# EAGLE design SensorNode_A (EAGLE 5.11)
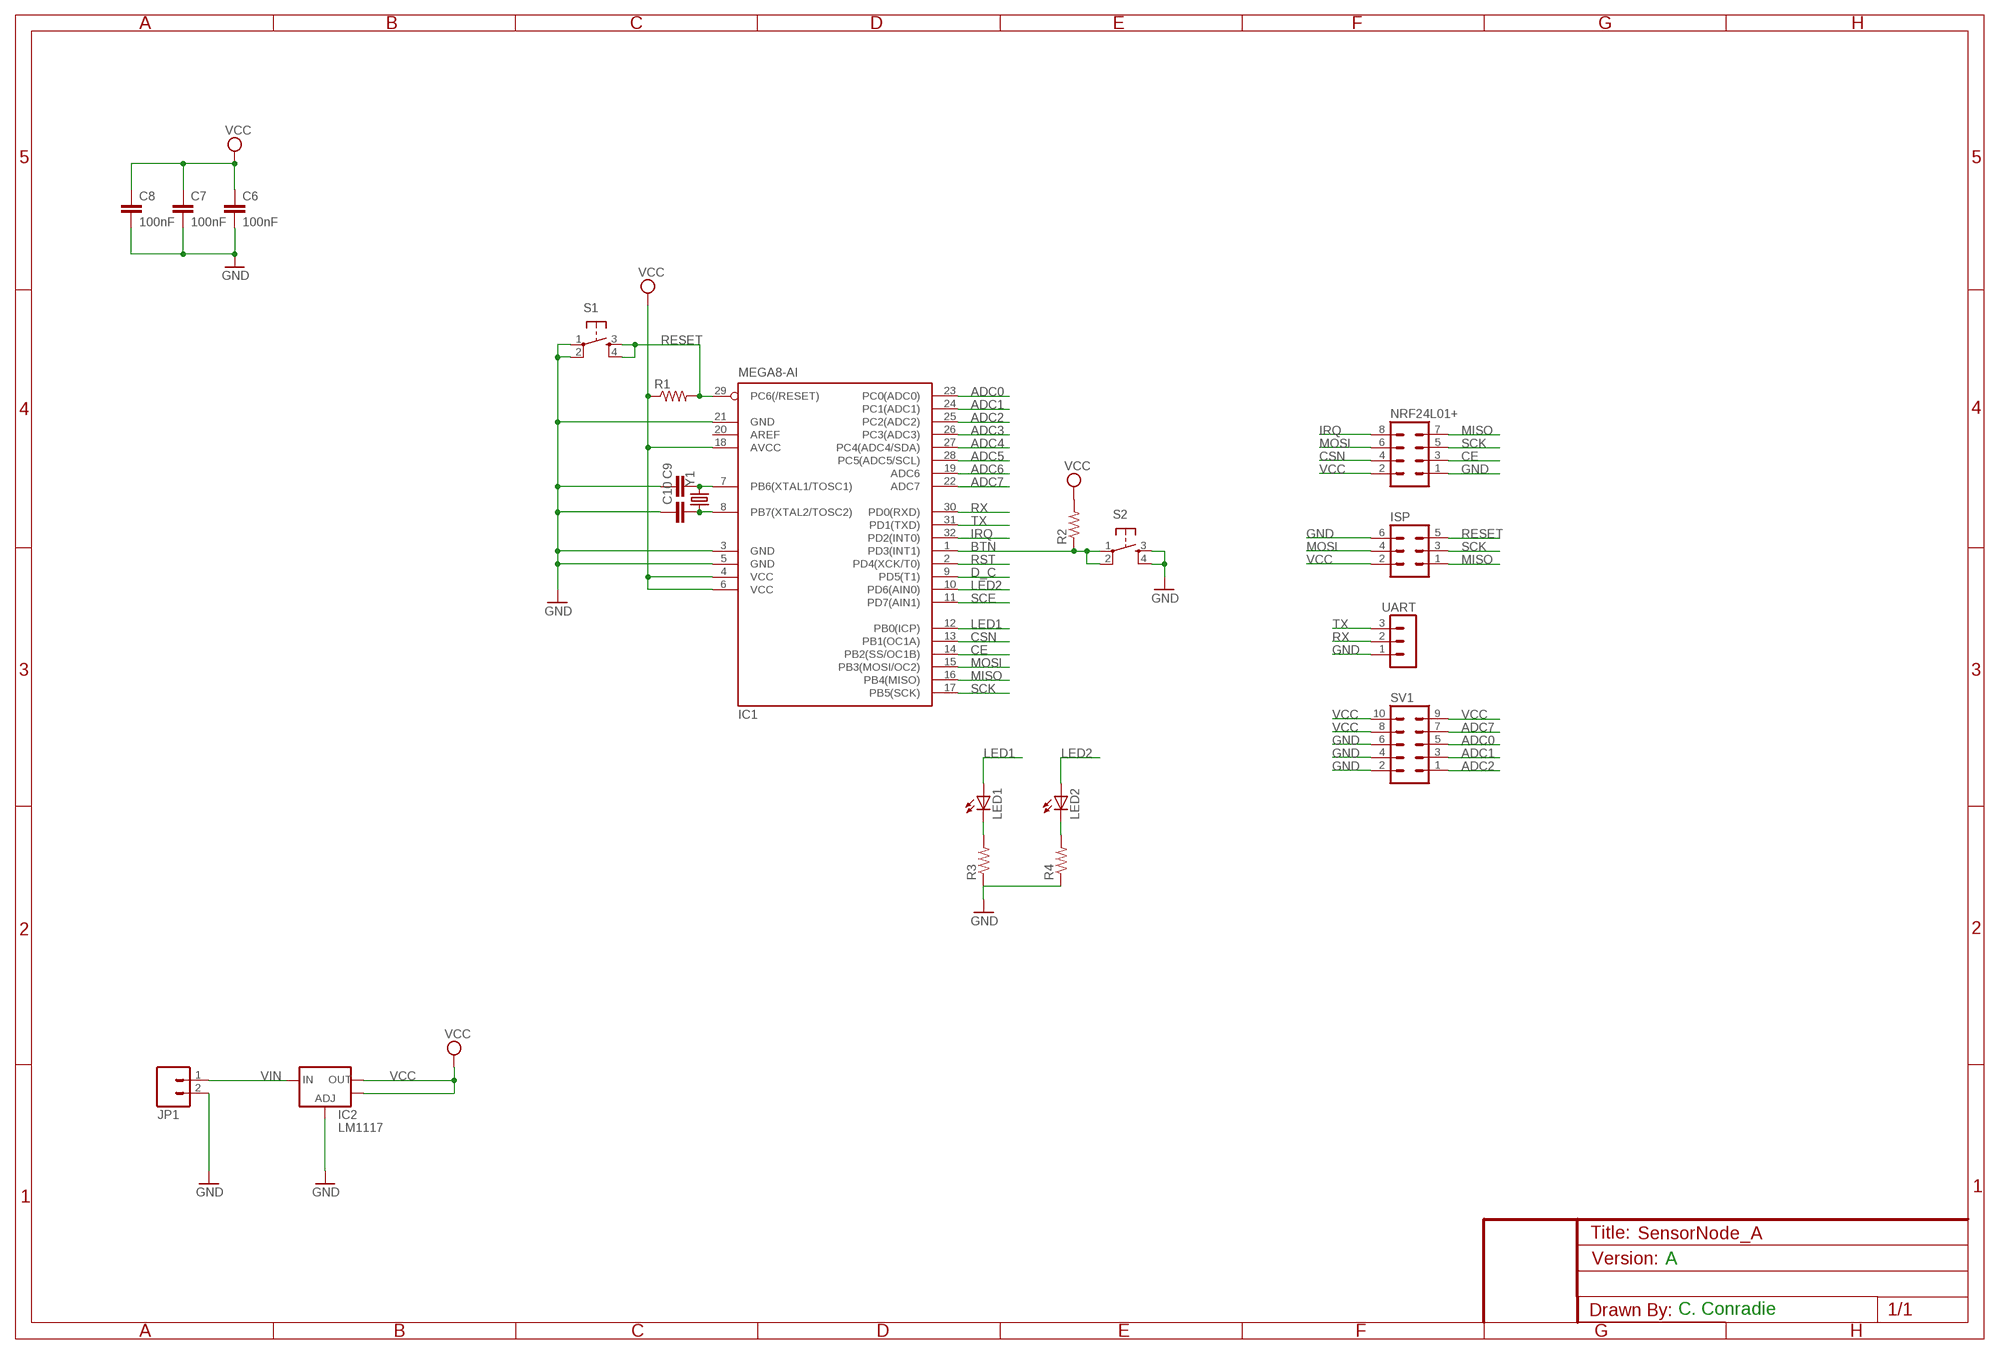
[diagram p0: schematic, sheet 1]

## Parts
C6  100nF  CAP1206  [1206]
C7  100nF  CAP1206  [1206]
C8  100nF  CAP1206  [1206]
C9  CAP0805  [0805]
C10  CAP0805  [0805]
IC1  MEGA8-AI  [TQFP32-08]
IC2  LM1117  V_REG_LM1117SOT223  [SOT223]
ISP  MA03-2  [MA03-2]
JP1  M02POLAR  [MOLEX-1X2]
LED1  LED1206  [LED-1206]
LED2  LED1206  [LED-1206]
NRF24L01+  MA04-2  [MA04-2]
R1  RESISTOR1206  [1206]
R2  RESISTOR1206  [1206]
R3  RESISTOR1206  [1206]
R4  RESISTOR1206  [1206]
S1  TAC_SWITCHSMD  [TACTILE_SWITCH_SMD]
S2  TAC_SWITCHSMD  [TACTILE_SWITCH_SMD]
SV1  MA05-2  [MA05-2]
UART  MA03-1  [MA03-1]
Y1  CRYSTALSMD  [HC49UP]

## Nets
ADC0: IC1.23(PC0(ADC0)) SV1.5
ADC1: IC1.24(PC1(ADC1)) SV1.3
ADC2: IC1.25(PC2(ADC2)) SV1.1
ADC3: IC1.26(PC3(ADC3))
ADC4: IC1.27(PC4(ADC4/SDA))
ADC5: IC1.28(PC5(ADC5/SCL))
ADC6: IC1.19(ADC6)
ADC7: IC1.22(ADC7) SV1.7
BTN: IC1.1(PD3(INT1)) R2.1 S2.1 S2.2
CE: IC1.14(PB2(SS/OC1B)) NRF24L01+.3
CSN: IC1.13(PB1(OC1A)) NRF24L01+.4
D_C: IC1.9(PD5(T1))
GND: C6.2 C7.2 C8.2 C9.1 C10.1 IC1.3(GND) IC1.5(GND) IC1.21(GND) IC2.1(ADJ) ISP.6 JP1.2 NRF24L01+.1 R3.1 R4.1 S1.1 S1.2 S2.3 S2.4 SV1.2 SV1.4 SV1.6 UART.1
IRQ: IC1.32(PD2(INT0)) NRF24L01+.8
LED1: IC1.12(PB0(ICP)) LED1.A
LED2: IC1.10(PD6(AIN0)) LED2.A
MISO: IC1.16(PB4(MISO)) ISP.1 NRF24L01+.7
MOSI: IC1.15(PB3(MOSI/OC2)) ISP.4 NRF24L01+.6
N$1: C9.2 IC1.7(PB6(XTAL1/TOSC1)) Y1.2
N$2: C10.2 IC1.8(PB7(XTAL2/TOSC2)) Y1.1
N$6: LED1.C R3.2
N$7: LED2.C R4.2
RESET: IC1.29(PC6(/RESET)) ISP.5 R1.2 S1.3 S1.4
RST: IC1.2(PD4(XCK/T0))
RX: IC1.30(PD0(RXD)) UART.2
SCE: IC1.11(PD7(AIN1))
SCK: IC1.17(PB5(SCK)) ISP.3 NRF24L01+.5
TX: IC1.31(PD1(TXD)) UART.3
VCC: C6.1 C7.1 C8.1 IC1.4(VCC) IC1.6(VCC) IC1.18(AVCC) IC2.2(OUT) IC2.4(OUT) ISP.2 NRF24L01+.2 R1.1 R2.2 SV1.8 SV1.9 SV1.10
VIN: IC2.3(IN) JP1.1
Unconnected: IC1.20(AREF)

## Notes on the sheet
- A
- C. Conradie

## Library data of the parts
C6-C10 = SparkFun:CAP: Capacitor Standard 0603 ceramic capacitor, and 0.1" leaded capacitor.
IC1 = atmel:MEGA8: MICROCONTROLLER 8 Kbytes FLASH, 1 kbytes SRAM, 512 bytes EEPROM, USART, 6-channel 10 bit ADC, 2-channel 8 bit ADC Pin compatible with Atmega48, ATMega88, ATMega168 Source: avr.lbr; MPN: ATMEGA8-16AU; OC_FARNELL: 9171371; OC_NEWARK: 73M8863
IC2 = SparkFun:V_REG_LM1117: Voltage Regulator LM1117 Standard adjustable voltage regulator but in SMD form. Spark Fun Electronics SKU : COM-00595
ISP = con-lstb:MA03-2: PIN HEADER; OC_FARNELL: unknown; OC_NEWARK: unknown
JP1 = SparkFun:M02: Header 2 Standard 2-pin 0.1" header. Use with straight break away headers (SKU : PRT-00116), right angle break away headers (PRT-00553), swiss pins (PRT-00743), machine pins (PRT-00117), and female headers (PRT-00115). Molex polarized connector foot print use with SKU : PRT-08233 with associated crimp pins and housings.
LED1 LED2 = SparkFun:LED: LEDs Standard schematic elements and footprints for 5mm, 3mm, 1206, and 0603 sized LEDs. 5mm - Spark Fun Electronics SKU : COM-00529 (and others)
NRF24L01+ = con-lstb:MA04-2: PIN HEADER; OC_FARNELL: unknown; OC_NEWARK: unknown
R1-R4 = SparkFun:RESISTOR: Resistor Basic schematic elements and footprints for 0603, 1206, and PTH resistors.
S1 S2 = SparkFun:TAC_SWITCH: Momentary Switch Button commonly used for reset or general input. Spark Fun Electronics SKU : COM-00097
SV1 = con-lstb:MA05-2: PIN HEADER; OC_FARNELL: unknown; OC_NEWARK: unknown
UART = con-lstb:MA03-1: PIN HEADER; OC_FARNELL: unknown; OC_NEWARK: unknown
Y1 = SparkFun:CRYSTAL: Crystals Various standard crystals. Proven footprints. Spark Fun Electronics SKU : COM-00534

## Board
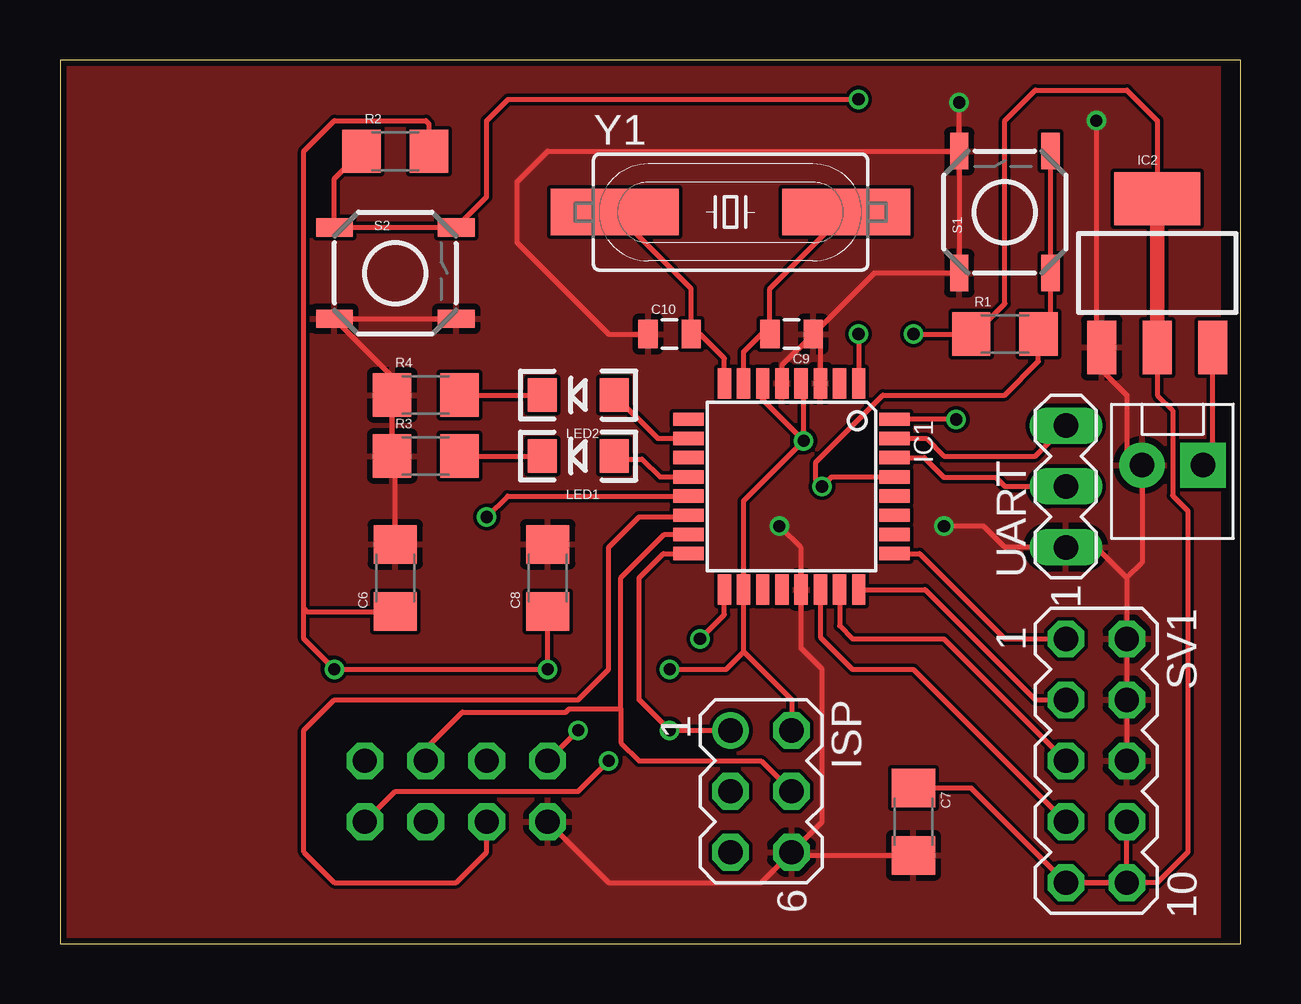
[diagram p1: board, top side]
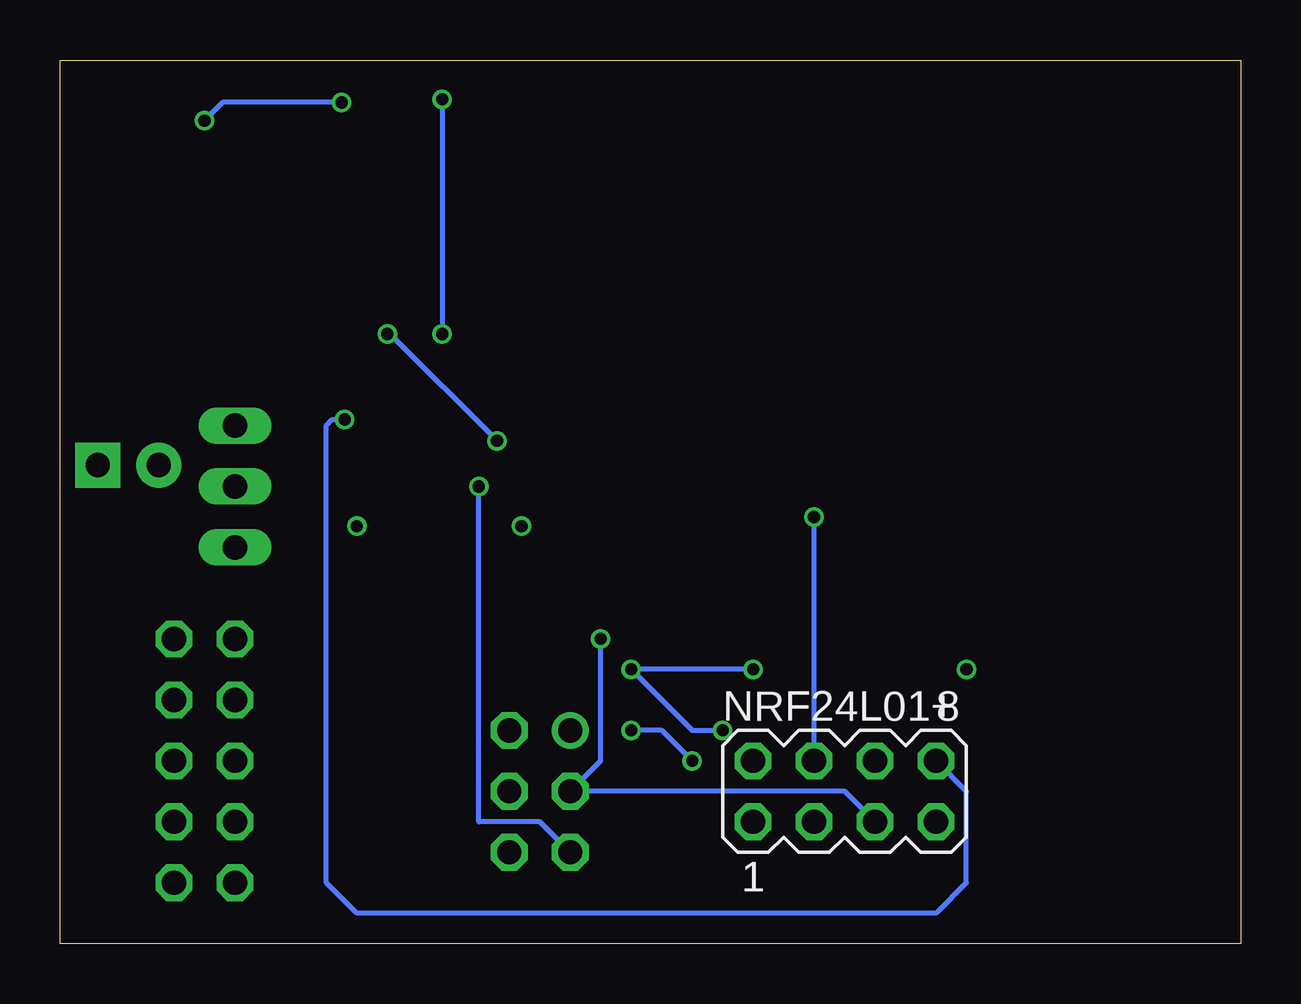
[diagram p2: board, bottom side, seen from below]

Size 49.2 x 36.82 mm. Coordinates in mm from the lower left corner, seen from the top.
Outline: 0,0 49.2,0 49.2,36.82 0,36.82 0,0
Copper layers (1*16): Top 0.035mm / dielectric 1.5mm / Bottom 0.035mm
Design rules "ITead_rule": minimum track width 6mil, minimum drill 12mil, track to track 6mil, track to pad 6mil, pad to pad 6mil, via to via 6mil, smd to smd 0mil, copper to edge 10mil, drill to drill 10mil, minimum pad ring 10mil, minimum via ring 6mil, stop-mask expansion 2mil, vias tented up to drill 100mil, thermal gap 10mil

### Footprints (pad centres in the part's own frame; a part is rotated, then mirrored left to right if it is on the bottom)
1206 = smd 1.6 x 1.8: 1 -1.4,0; 2 1.4,0
0805 = smd 0.8 x 1.2: 1 -0.9,0; 2 0.9,0
TQFP32-08 = smd 1.27 x 0.559: 1 -4.293,2.8; 2 -4.293,2; 3 -4.293,1.2; 4 -4.293,0.4; 5 -4.293,-0.4; 6 -4.293,-1.2; 7 -4.293,-2; 8 -4.293,-2.8; 17 4.293,-2.8; 18 4.293,-2; 19 4.293,-1.2; 20 4.293,-0.4; 21 4.293,0.4; 22 4.293,1.2; 23 4.293,2; 24 4.293,2.8 | smd 0.559 x 1.27: 9 -2.8,-4.293; 10 -2,-4.293; 11 -1.2,-4.293; 12 -0.4,-4.293; 13 0.4,-4.293; 14 1.2,-4.293; 15 2,-4.293; 16 2.8,-4.293; 25 2.8,4.293; 26 2,4.293; 27 1.2,4.293; 28 0.4,4.293; 29 -0.4,4.293; 30 -1.2,4.293; 31 -2,4.293; 32 -2.8,4.293
SOT223 = smd 1.219 x 2.235: 1 -2.311,-3.099; 2 0,-3.099; 3 2.311,-3.099 | smd 3.6 x 2.2: 4 0,3.099
MA03-2 = drill 1.016 round: 1 -2.54,-1.27 | drill 1.016 octagon: 2 -2.54,1.27; 3 0,-1.27; 4 0,1.27; 5 2.54,-1.27; 6 2.54,1.27
MOLEX-1X2 = drill 1.016 pad 1.88 square: 1 0,0 | drill 1.016 pad 1.88 round: 2 2.54,0
LED-1206 = smd 1.2 x 1.4: A -1.5,0; C 1.5,0
MA04-2 = drill 1.016 octagon: 1 -3.81,-1.27; 2 -3.81,1.27; 3 -1.27,-1.27; 4 -1.27,1.27; 5 1.27,-1.27; 6 1.27,1.27; 7 3.81,-1.27; 8 3.81,1.27
TACTILE_SWITCH_SMD = smd 1.524 x 0.762: 1 -2.54,1.905; 2 2.54,1.905; 3 -2.54,-1.905; 4 2.54,-1.905
MA05-2 = drill 1.016 octagon: 1 -5.08,-1.27; 2 -5.08,1.27; 3 -2.54,-1.27; 4 -2.54,1.27; 5 0,-1.27; 6 0,1.27; 7 2.54,-1.27; 8 2.54,1.27; 9 5.08,-1.27; 10 5.08,1.27
MA03-1 = drill 1.016 long: 1 -2.54,0; 2 0,0; 3 2.54,0
HC49UP = smd 5.334 x 1.93: 1 -4.826,0; 2 4.826,0

### Placement (x,y rotation side)
C6  13.97,15.24 90 top
C7  35.56,5.08 270 top
C8  20.32,15.24 90 top
C9  30.48,25.4 180 top
C10  25.4,25.4 0 top
IC1  30.48,19.05 270 top
IC2  45.72,27.94 0 top
ISP  29.21,6.35 270 top
JP1  47.62,19.94 180 top
LED1  21.59,20.32 180 top
LED2  21.59,22.86 180 top
NRF24L01+  16.51,6.35 0 bottom
R1  39.37,25.4 0 top
R2  13.97,33.02 0 top
R3  15.24,20.32 0 top
R4  15.24,22.86 0 top
S1  39.37,30.48 90 top
S2  13.97,27.94 0 top
SV1  43.18,7.62 270 top
UART  41.91,19.05 90 top
Y1  27.94,30.48 0 top

### Tracks (layer width: path | path; a pad name or v marks a point on that pad's centre or on a via)
ADC0
  Top 0.203: IC1.23 32.48,13.24 33.02,12.7 36.83,12.7 SV1.5
ADC1
  Top 0.203: IC1.24 36.04,14.76 40.64,10.16 SV1.3
ADC2
  Top 0.203: IC1.25 35.82,16.25 39.37,12.7 SV1.1
ADC7
  Top 0.203: IC1.22 31.68,12.77 33.02,11.43 35.56,11.43 SV1.7
BTN  (via drill 0.51)
  Top 0.203: IC1.1 v33.28,25.39 v33.27,25.4 | v33.27,35.18 18.67,35.18 17.78,34.29 17.78,31.11 S2.2 S2.1 11.43,31.88 R2.1
  Bottom 0.203: v33.27,35.18 v33.27,25.4
CE
  Top 0.203: NRF24L01+.3 17.78,3.81 16.51,2.54 11.43,2.54 10.16,3.81 10.16,8.89 11.43,10.16 21.59,10.16 22.86,11.43 22.86,16.51 24.13,17.78 26.12,17.78 IC1.14
CSN  (via drill 0.51)
  Top 0.203: IC1.13 18.65,18.65 v17.78,17.78
  Bottom 0.203: NRF24L01+.4 v17.78,17.78
GND  (via drill 0.51)
  Top 0.203: ISP.6 31.75,5.08 31.75,11.43 30.88,12.3 IC1.21 30.88,16.49 v29.97,17.4 | ISP.6 29.21,2.54 22.86,2.54 NRF24L01+.1 | C9.1 33.92,27.94 S1.1 S1.2 | IC1.3 31.68,25.1 C9.1 | SV1.6 SV1.4 SV1.2 44.45,15.24 | 44.45,15.24 43.18,16.51 UART.1 39.37,16.51 38.48,17.4 v36.83,17.4 | 43.41,24.13 43.41,23.9 44.45,22.86 44.45,20.57 JP1.2 45.09,15.88 44.45,15.24 | 43.41,24.13 IC2.1 | S1.2 v37.47,35.05 | v43.18,34.29 43.18,24.36 43.41,24.13 | IC1.5 30.08,24.1 C9.1 | C10.1 22.86,25.4 19.05,29.21 19.05,31.75 20.32,33.02 S1.2 | S2.4 S2.3 13.84,23.62 R4.1 R3.1 13.97,20.19 C6.2 | C7.2 30.61,3.68 ISP.6
  Bottom 0.203: v37.47,35.05 42.42,35.05 v43.18,34.29
  pour Top: 0,36.83 48.26,36.83 48.26,0 0,0
  pour Top (isolate 0.254): 0,36.83 22.86,36.83 22.86,0 0,0
IRQ  (via drill 0.51)
  Top 0.203: IC1.32 v37.33,21.85 v37.34,21.84
  Bottom 0.203: v37.34,21.84 37.85,21.84 38.1,21.59 38.1,2.54 36.83,1.27 12.7,1.27 11.43,2.54 11.43,6.35 NRF24L01+.8
LED1
  Top 0.203: IC1.12 25,19.45 24.26,20.19 23.22,20.19 LED1.A
LED2
  Top 0.203: IC1.10 24.9,21.05 LED2.A
MISO  (via drill 0.51)
  Top 0.203: IC1.16 25.14,16.25 24.13,15.24 24.13,10.16 v25.4,8.89 ISP.1 | v22.86,7.62 21.59,6.35 13.97,6.35 NRF24L01+.7
  Bottom 0.203: v25.4,8.89 24.13,8.89 v22.86,7.62
MOSI
  Top 0.203: IC1.15 25.18,17.05 23.37,15.24 23.37,9.78 | 23.37,9.78 23.37,8.38 24.13,7.62 29.21,7.62 ISP.4 | NRF24L01+.6 15.24,8.13 16.76,9.65 21.08,9.65 21.21,9.78 23.37,9.78
N$1
  Top 0.203: IC1.7 28.48,24.67 29.21,25.4 C9.2 29.58,27.29 Y1.2
N$2
  Top 0.203: IC1.8 27.68,24.39 26.67,25.4 C10.2 26.3,27.29 Y1.1
N$6
  Top 0.203: 16.51,20.32 R3.2 LED1.C
N$7
  Top 0.203: 16.51,22.86 R4.2 LED2.C
RESET  (via drill 0.51)
  Top 0.203: IC1.29 32.15,19.45 v31.75,19.05 31.5,19.3 31.5,20.07 34.29,22.86 39.37,22.86 40.77,24.26 R1.2 41.27,25.91 S1.3 S1.4
  Bottom 0.203: v31.75,19.05 31.75,5.08 29.21,5.08 ISP.5
RX
  Top 0.203: IC1.30 36.01,20.25 36.83,19.43 38.99,19.43 39.37,19.05 UART.2
SCK  (via drill 0.51)
  Top 0.203: IC1.17 27.68,13.71 v26.67,12.7
  Bottom 0.203: v26.67,12.7 26.67,7.62 ISP.3 16.51,6.35 NRF24L01+.5
TX
  Top 0.203: IC1.31 36.1,21.05 36.83,20.32 40.64,20.32 UART.3
VCC  (via drill 0.51)
  Top 0.203: 28.48,12.16 IC1.18 28.48,18.45 v30.99,20.95 | 28.48,12.16 30.48,10.16 ISP.2 | v21.59,8.89 NRF24L01+.2 | v25.4,11.43 27.75,11.43 28.48,12.16 | IC2.4 45.72,34.29 44.45,35.56 40.64,35.56 39.37,34.29 39.37,26.67 38.1,25.4 R1.1 v35.56,25.4 | v30.99,20.95 30.99,23.23 IC1.4 | IC1.6 29.28,22.66 v30.99,20.95 | R2.2 15.37,34.16 15.24,34.29 11.43,34.29 10.16,33.02 10.16,13.97 | 10.16,13.97 10.16,12.7 v11.43,11.43 v20.32,11.43 C8.1 | SV1.9 SV1.10 SV1.8 | SV1.9 45.72,2.54 46.99,3.81 46.99,18.03 46.35,18.67 46.35,22.23 45.72,22.86 IC2.2 | C6.1 10.29,13.84 10.16,13.97 | C7.1 37.97,6.48 SV1.9
  Top 0.61: IC2.4 IC2.2
  Bottom 0.203: v21.59,8.89 22.86,8.89 v25.4,11.43 v20.32,11.43 | v35.56,25.4 35.43,25.4 v30.99,20.95
VIN
  Top 0.203: IC2.3 48.03,20.34 JP1.1